# Altium schematic sheet CONTROL_485.SchDoc
size A2; SheetNumber: 1; SheetTotal: 4; DocumentName: MII_RESET.SCHDOC
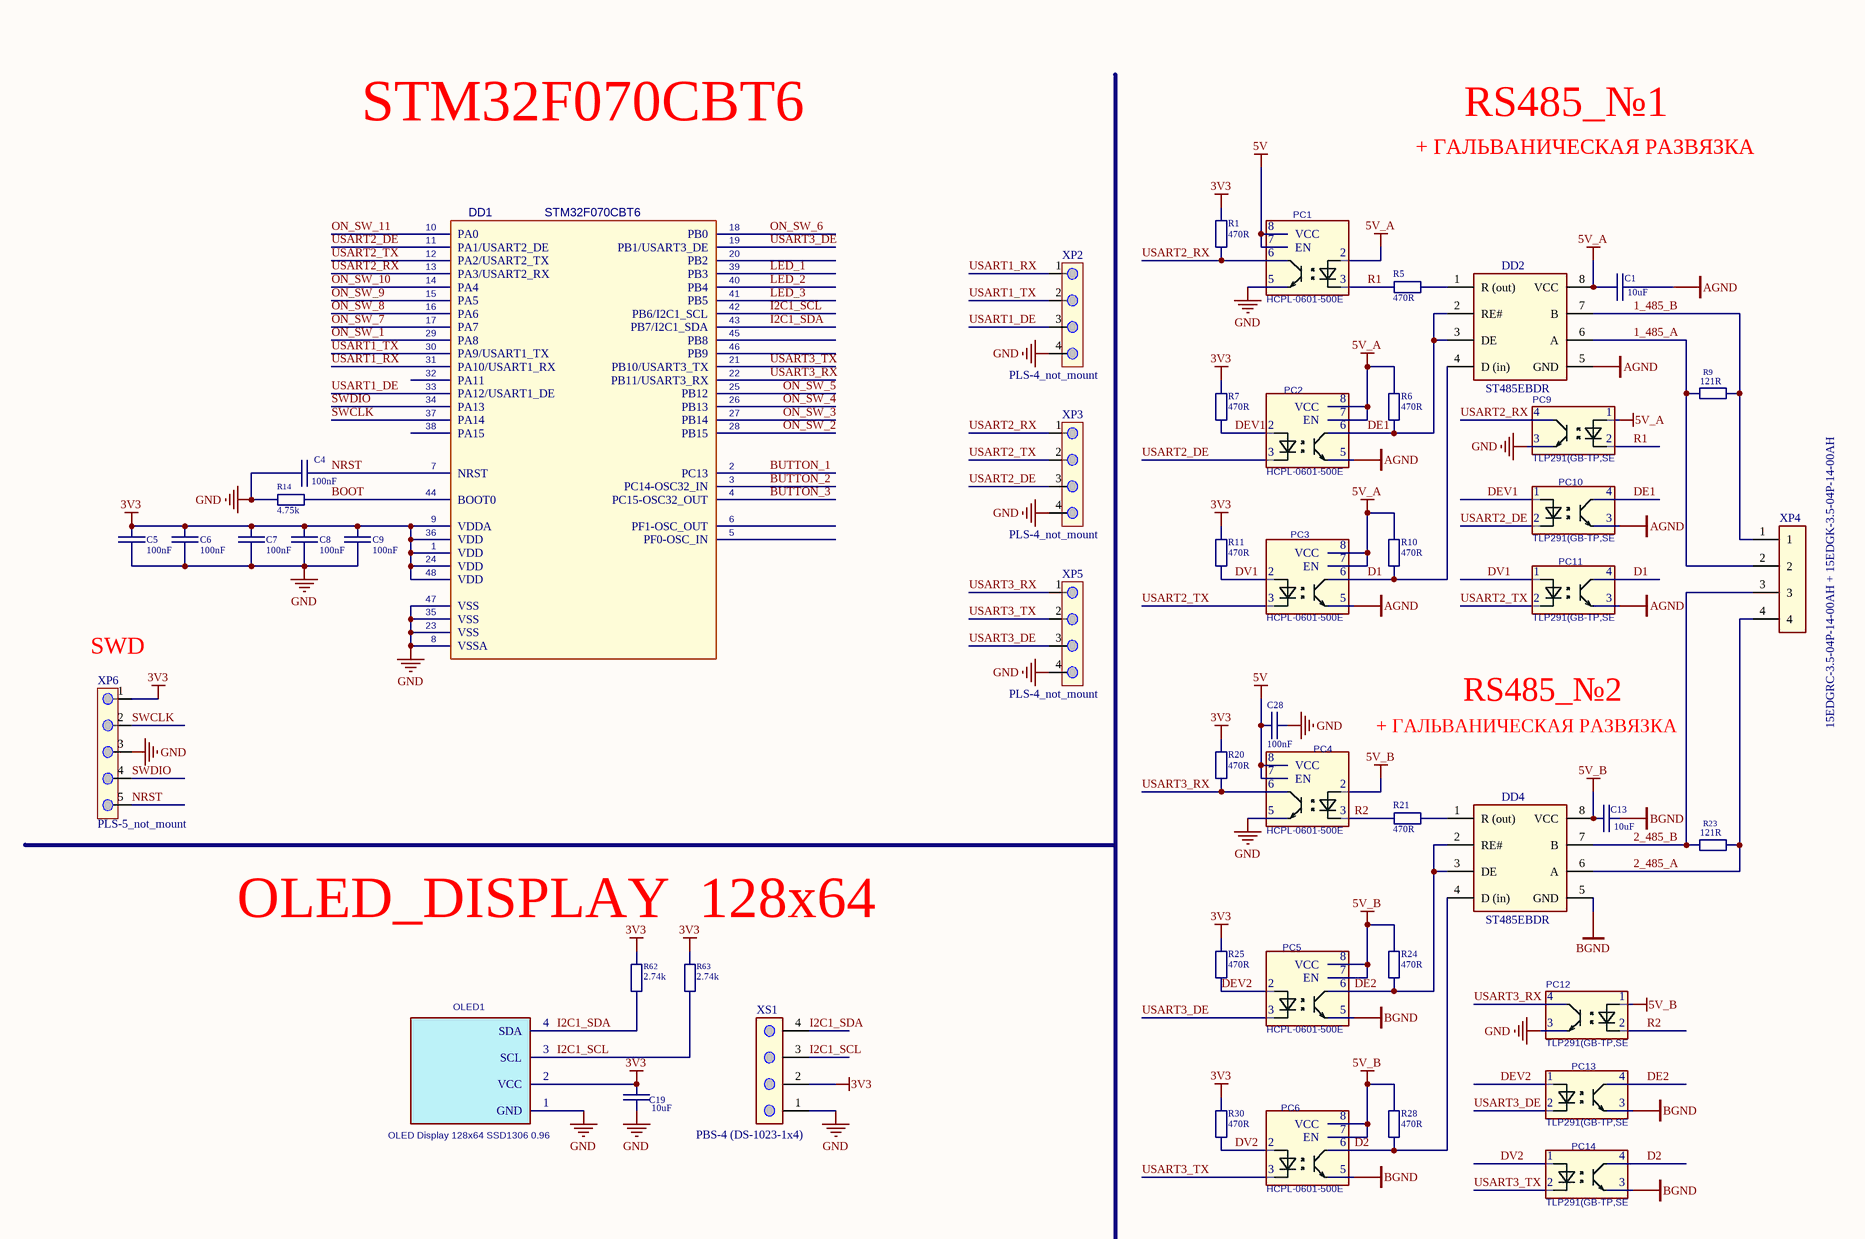
[diagram p0: CONTROL_485.SchDoc, top left]
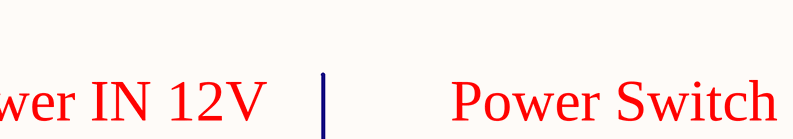
[diagram p1: CONTROL_485.SchDoc, top right]
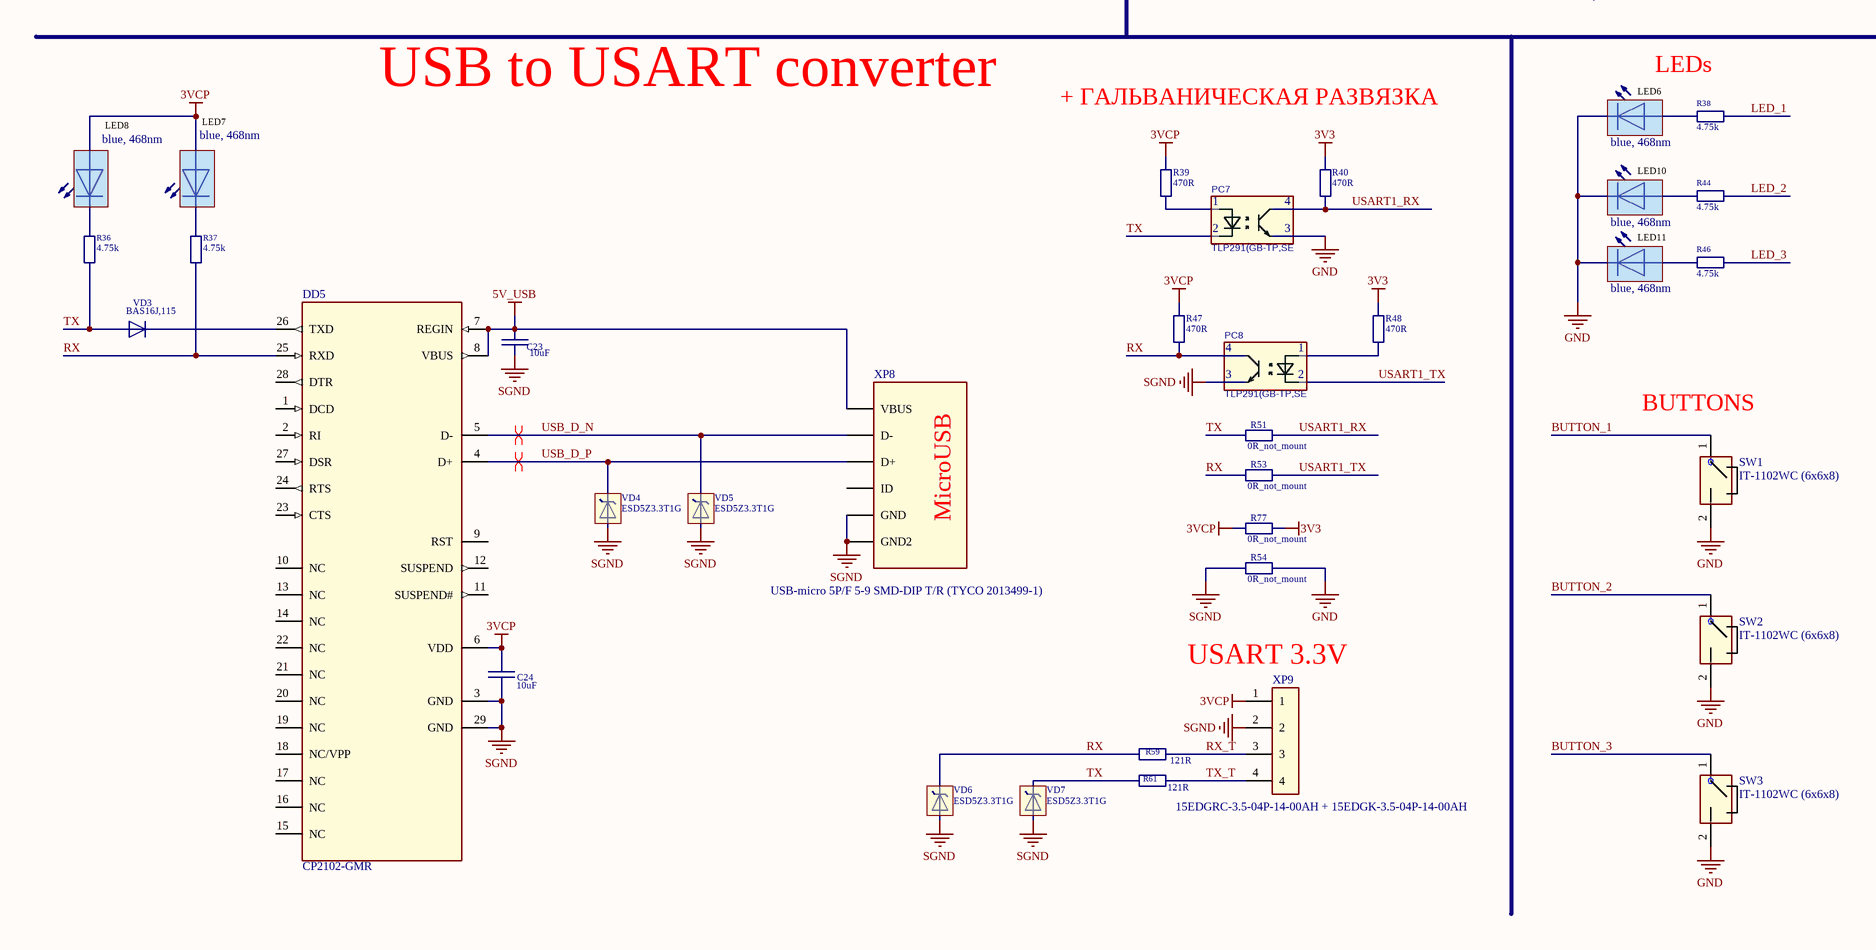
[diagram p2: CONTROL_485.SchDoc, bottom left]
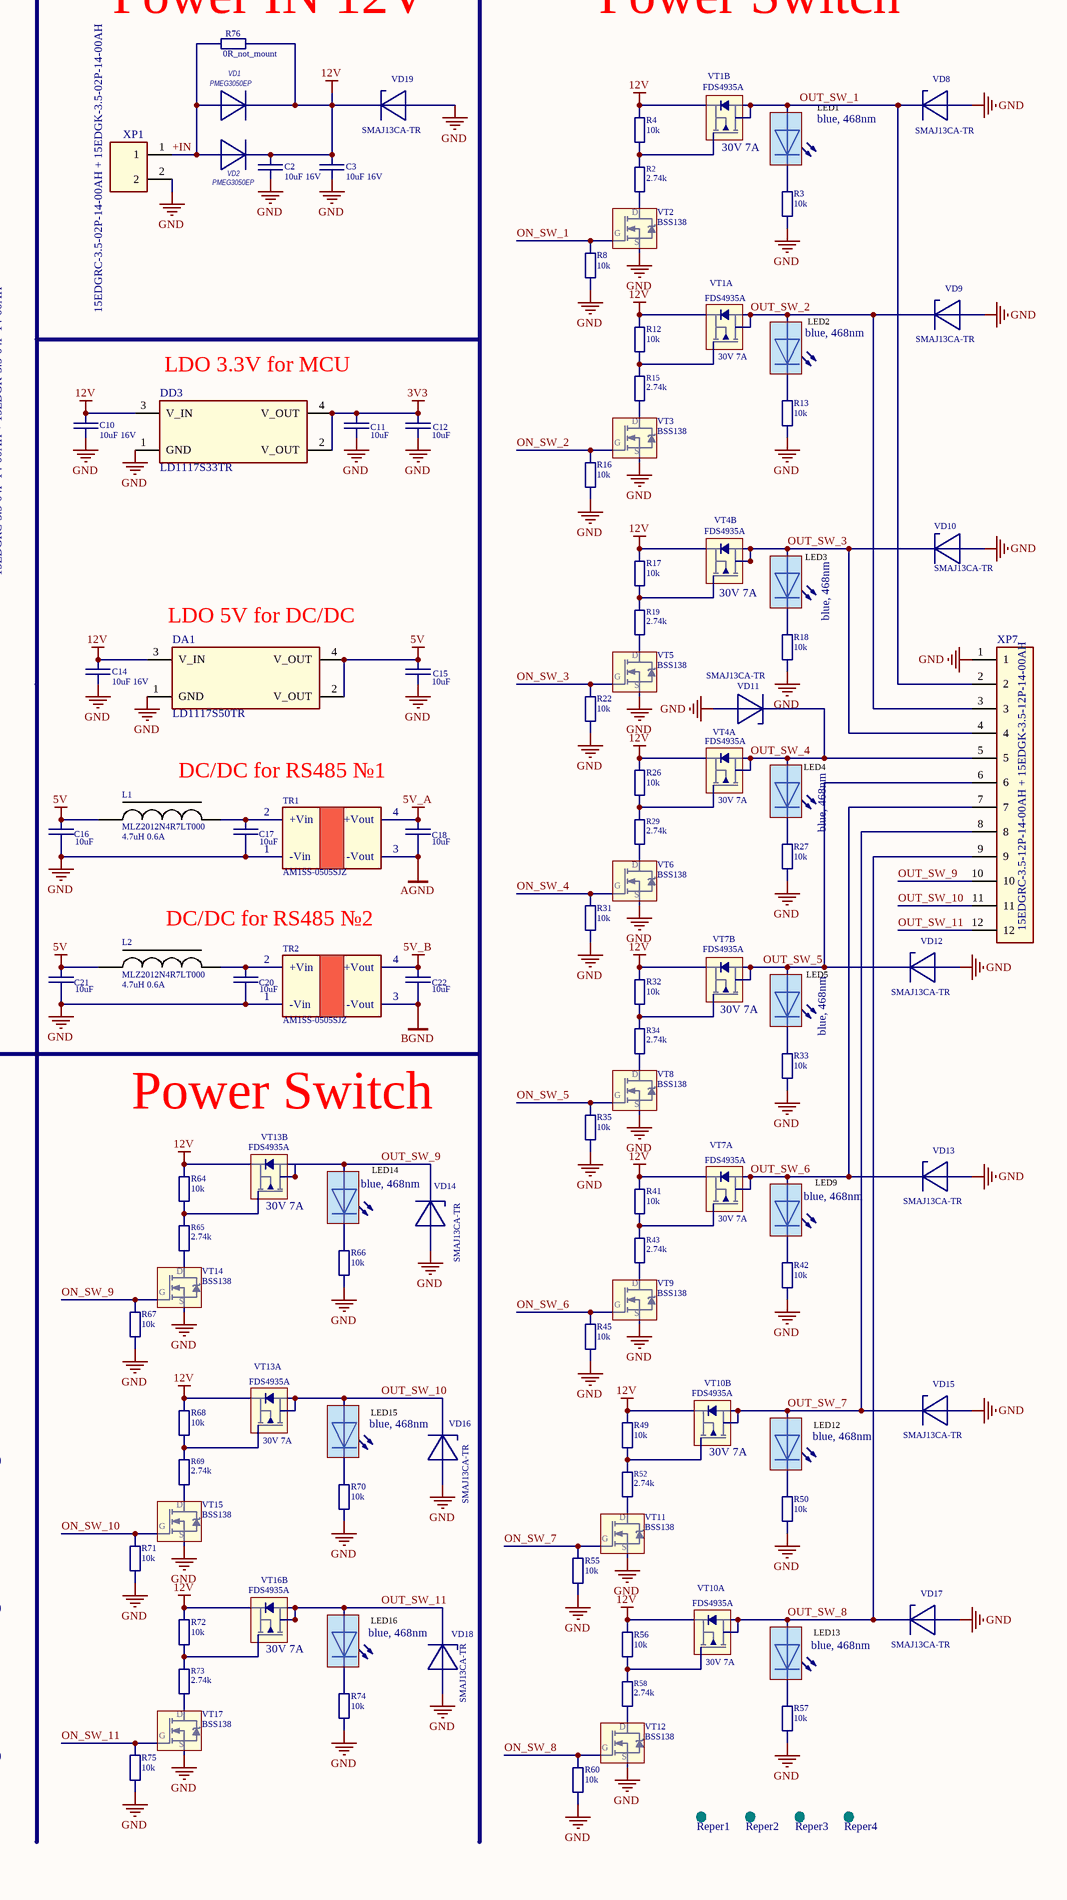
[diagram p3: CONTROL_485.SchDoc, bottom right]

## Parts
C1  Capacitance: 10uF  [C0805]  (hidden comment: C0805, 10uF, 10V, X5R)
C2  Capacitance: 10uF 16V  [C0805]  (hidden comment: C0805, 10uF, 16V, X5R)
C3  Capacitance: 10uF 16V  [C0805]  (hidden comment: C0805, 10uF, 16V, X5R)
C4  Capacitance: 100nF  [C0603]  (hidden comment: C0603, 100nF 50V)
C5  Capacitance: 100nF  [C0603]  (hidden comment: C0603, 100nF 50V)
C6  Capacitance: 100nF  [C0603]  (hidden comment: C0603, 100nF 50V)
C7  Capacitance: 100nF  [C0603]  (hidden comment: C0603, 100nF 50V)
C8  Capacitance: 100nF  [C0603]  (hidden comment: C0603, 100nF 50V)
C9  Capacitance: 100nF  [C0603]  (hidden comment: C0603, 100nF 50V)
C10  Capacitance: 10uF 16V  [C0805]  (hidden comment: C0805, 10uF, 16V, X5R)
C11  Capacitance: 10uF  [C0805]  (hidden comment: C0805, 10uF, 10V, X5R)
C12  Capacitance: 10uF  [C0805]  (hidden comment: C0805, 10uF, 10V, X5R)
C13  Capacitance: 10uF  [C0805]  (hidden comment: C0805, 10uF, 10V, X5R)
C14  Capacitance: 10uF 16V  [C0805]  (hidden comment: C0805, 10uF, 16V, X5R)
C15  Capacitance: 10uF  [C0805]  (hidden comment: C0805, 10uF, 10V, X5R)
C16  Capacitance: 10uF  [C0805]  (hidden comment: C0805, 10uF, 10V, X5R)
C17  Capacitance: 10uF  [C0805]  (hidden comment: C0805, 10uF, 10V, X5R)
C18  Capacitance: 10uF  [C0805]  (hidden comment: C0805, 10uF, 10V, X5R)
C19  Capacitance: 10uF  [C0805]  (hidden comment: C0805, 10uF, 10V, X5R)
C20  Capacitance: 10uF  [C0805]  (hidden comment: C0805, 10uF, 10V, X5R)
C21  Capacitance: 10uF  [C0805]  (hidden comment: C0805, 10uF, 10V, X5R)
C22  Capacitance: 10uF  [C0805]  (hidden comment: C0805, 10uF, 10V, X5R)
C23  Capacitance: 10uF  [C0805]  (hidden comment: C0805, 10uF, 10V, X5R)
C24  Capacitance: 10uF  [C0805]  (hidden comment: C0805, 10uF, 10V, X5R)
C28  Capacitance: 100nF  [C0603]  (hidden comment: C0603, 100nF 50V)
DA1  LD1117S50TR  [SOT223_N]
DD1  STM32F070CBT6  [LQFP48_L]
DD2  ST485EBDR  [SO-8_L]
DD3  LD1117S33TR  [SOT223_N]
DD4  ST485EBDR  [SO-8_L]
DD5  CP2102-GMR  [QFN28]
L1  MLZ2012N4R7LT000  [L0805]
L2  MLZ2012N4R7LT000  [L0805]
LED1  FYLS-0805BUBC  [LED_0805_B]  (value not drawn)
LED2  FYLS-0805BUBC  [LED_0805_B]  (value not drawn)
LED3  FYLS-0805BUBC  [LED_0805_B]  (value not drawn)
LED4  FYLS-0805BUBC  [LED_0805_B]  (value not drawn)
LED5  FYLS-0805BUBC  [LED_0805_B]  (value not drawn)
LED6  FYLS-0805BUBC  [LED_0805_B]  (value not drawn)
LED7  FYLS-0805BUBC  [LED_0805_B]  (value not drawn)
LED8  FYLS-0805BUBC  [LED_0805_B]  (value not drawn)
LED9  FYLS-0805BUBC  [LED_0805_B]  (value not drawn)
LED10  FYLS-0805BUBC  [LED_0805_B]  (value not drawn)
LED11  FYLS-0805BUBC  [LED_0805_B]  (value not drawn)
LED12  FYLS-0805BUBC  [LED_0805_B]  (value not drawn)
LED13  FYLS-0805BUBC  [LED_0805_B]  (value not drawn)
LED14  FYLS-0805BUBC  [LED_0805_B]  (value not drawn)
LED15  FYLS-0805BUBC  [LED_0805_B]  (value not drawn)
LED16  FYLS-0805BUBC  [LED_0805_B]  (value not drawn)
OLED1  OLED Display 128x64 SSD1306 0.96  [OLED Display 128x64 SSD1306 0.96]
PC1  HCPL-0601-500E  [SO-8_HCPL]
PC2  HCPL-0601-500E  [SO-8_HCPL]
PC3  HCPL-0601-500E  [SO-8_HCPL]
PC4  HCPL-0601-500E  [SO-8_HCPL]
PC5  HCPL-0601-500E  [SO-8_HCPL]
PC6  HCPL-0601-500E  [SO-8_HCPL]
PC7  TLP291(GB-TP,SE  [TLP292]
PC8  TLP291(GB-TP,SE  [TLP292]
PC9  TLP291(GB-TP,SE  [TLP292]
PC10  TLP291(GB-TP,SE  [TLP292]
PC11  TLP291(GB-TP,SE  [TLP292]
PC12  TLP291(GB-TP,SE  [TLP292]
PC13  TLP291(GB-TP,SE  [TLP292]
PC14  TLP291(GB-TP,SE  [TLP292]
R1  R0603, 470R 1%  [R0603]  (value not drawn)
R2  Resistance: 2.74k  [R0603]  (hidden comment: R0603, 2.74k 1%)
R3  Resistance: 10k  [R0603]  (hidden comment: R0603, 10k 1%)
R4  Resistance: 10k  [R0603]  (hidden comment: R0603, 10k 1%)
R5  R0603, 470R 1%  [R0603]  (value not drawn)
R6  R0603, 470R 1%  [R0603]  (value not drawn)
R7  R0603, 470R 1%  [R0603]  (value not drawn)
R8  Resistance: 10k  [R0603]  (hidden comment: R0603, 10k 1%)
R9  Resistance: 121R  [R0603]  (hidden comment: R0603, 121R 1%)
R10  R0603, 470R 1%  [R0603]  (value not drawn)
R11  R0603, 470R 1%  [R0603]  (value not drawn)
R12  Resistance: 10k  [R0603]  (hidden comment: R0603, 10k 1%)
R13  Resistance: 10k  [R0603]  (hidden comment: R0603, 10k 1%)
R14  Resistance: 4.75k  [R0603]  (hidden comment: R0603, 4.75k 1%)
R15  Resistance: 2.74k  [R0603]  (hidden comment: R0603, 2.74k 1%)
R16  Resistance: 10k  [R0603]  (hidden comment: R0603, 10k 1%)
R17  Resistance: 10k  [R0603]  (hidden comment: R0603, 10k 1%)
R18  Resistance: 10k  [R0603]  (hidden comment: R0603, 10k 1%)
R19  Resistance: 2.74k  [R0603]  (hidden comment: R0603, 2.74k 1%)
R20  R0603, 470R 1%  [R0603]  (value not drawn)
R21  R0603, 470R 1%  [R0603]  (value not drawn)
R22  Resistance: 10k  [R0603]  (hidden comment: R0603, 10k 1%)
R23  Resistance: 121R  [R0603]  (hidden comment: R0603, 121R 1%)
R24  R0603, 470R 1%  [R0603]  (value not drawn)
R25  R0603, 470R 1%  [R0603]  (value not drawn)
R26  Resistance: 10k  [R0603]  (hidden comment: R0603, 10k 1%)
R27  Resistance: 10k  [R0603]  (hidden comment: R0603, 10k 1%)
R28  R0603, 470R 1%  [R0603]  (value not drawn)
R29  Resistance: 2.74k  [R0603]  (hidden comment: R0603, 2.74k 1%)
R30  R0603, 470R 1%  [R0603]  (value not drawn)
R31  Resistance: 10k  [R0603]  (hidden comment: R0603, 10k 1%)
R32  Resistance: 10k  [R0603]  (hidden comment: R0603, 10k 1%)
R33  Resistance: 10k  [R0603]  (hidden comment: R0603, 10k 1%)
R34  Resistance: 2.74k  [R0603]  (hidden comment: R0603, 2.74k 1%)
R35  Resistance: 10k  [R0603]  (hidden comment: R0603, 10k 1%)
R36  Resistance: 4.75k  [R0603]  (hidden comment: R0603, 4.75k 1%)
R37  Resistance: 4.75k  [R0603]  (hidden comment: R0603, 4.75k 1%)
R38  Resistance: 4.75k  [R0603]  (hidden comment: R0603, 4.75k 1%)
R39  R0603, 470R 1%  [R0603]  (value not drawn)
R40  R0603, 470R 1%  [R0603]  (value not drawn)
R41  Resistance: 10k  [R0603]  (hidden comment: R0603, 10k 1%)
R42  Resistance: 10k  [R0603]  (hidden comment: R0603, 10k 1%)
R43  Resistance: 2.74k  [R0603]  (hidden comment: R0603, 2.74k 1%)
R44  Resistance: 4.75k  [R0603]  (hidden comment: R0603, 4.75k 1%)
R45  Resistance: 10k  [R0603]  (hidden comment: R0603, 10k 1%)
R46  Resistance: 4.75k  [R0603]  (hidden comment: R0603, 4.75k 1%)
R47  R0603, 470R 1%  [R0603]  (value not drawn)
R48  R0603, 470R 1%  [R0603]  (value not drawn)
R49  Resistance: 10k  [R0603]  (hidden comment: R0603, 10k 1%)
R50  Resistance: 10k  [R0603]  (hidden comment: R0603, 10k 1%)
R51  R0805, 0R_not_mount  [R0805]  (value not drawn)
R52  Resistance: 2.74k  [R0603]  (hidden comment: R0603, 2.74k 1%)
R53  R0805, 0R_not_mount  [R0805]  (value not drawn)
R54  R0805, 0R_not_mount  [R0805]  (value not drawn)
R55  Resistance: 10k  [R0603]  (hidden comment: R0603, 10k 1%)
R56  Resistance: 10k  [R0603]  (hidden comment: R0603, 10k 1%)
R57  Resistance: 10k  [R0603]  (hidden comment: R0603, 10k 1%)
R58  Resistance: 2.74k  [R0603]  (hidden comment: R0603, 2.74k 1%)
R59  Resistance: 121R  [R0603]  (hidden comment: R0603, 121R 1%)
R60  Resistance: 10k  [R0603]  (hidden comment: R0603, 10k 1%)
R61  Resistance: 121R  [R0603]  (hidden comment: R0603, 121R 1%)
R62  Resistance: 2.74k  [R0603]  (hidden comment: R0603, 2.74k 1%)
R63  Resistance: 2.74k  [R0603]  (hidden comment: R0603, 2.74k 1%)
R64  Resistance: 10k  [R0603]  (hidden comment: R0603, 10k 1%)
R65  Resistance: 2.74k  [R0603]  (hidden comment: R0603, 2.74k 1%)
R66  Resistance: 10k  [R0603]  (hidden comment: R0603, 10k 1%)
R67  Resistance: 10k  [R0603]  (hidden comment: R0603, 10k 1%)
R68  Resistance: 10k  [R0603]  (hidden comment: R0603, 10k 1%)
R69  Resistance: 2.74k  [R0603]  (hidden comment: R0603, 2.74k 1%)
R70  Resistance: 10k  [R0603]  (hidden comment: R0603, 10k 1%)
R71  Resistance: 10k  [R0603]  (hidden comment: R0603, 10k 1%)
R72  Resistance: 10k  [R0603]  (hidden comment: R0603, 10k 1%)
R73  Resistance: 2.74k  [R0603]  (hidden comment: R0603, 2.74k 1%)
R74  Resistance: 10k  [R0603]  (hidden comment: R0603, 10k 1%)
R75  Resistance: 10k  [R0603]  (hidden comment: R0603, 10k 1%)
R76  R0805, 0R_not_mount  [R0805]  (value not drawn)
R77  R0805, 0R_not_mount  [R0805]  (value not drawn)
Reper1  Reper  [REPER_1x3]  (value not drawn)  (no BOM)
Reper2  Reper  [REPER_1x3]  (value not drawn)  (no BOM)
Reper3  Reper  [REPER_1x3]  (value not drawn)  (no BOM)
Reper4  Reper  [REPER_1x3]  (value not drawn)  (no BOM)
SW1  IT-1102WC (6x6x8)  [IT-1102WC]
SW2  IT-1102WC (6x6x8)  [IT-1102WC]
SW3  IT-1102WC (6x6x8)  [IT-1102WC]
TR1  AM1SS-0505SJZ  [4-SIP (11.6x6x10.2)]
TR2  AM1SS-0505SJZ  [4-SIP (11.6x6x10.2)]
VD1  PMEG3050EP  [SOD128]
VD2  PMEG3050EP  [SOD128]
VD3  BAS16J,115  [SOD-323]
VD4  ESD5Z3.3T1G  [SOD-523]
VD5  ESD5Z3.3T1G  [SOD-523]
VD6  ESD5Z3.3T1G  [SOD-523]
VD7  ESD5Z3.3T1G  [SOD-523]
VD8  SMAJ13CA-TR  [SMA]
VD9  SMAJ13CA-TR  [SMA]
VD10  SMAJ13CA-TR  [SMA]
VD11  SMAJ13CA-TR  [SMA]
VD12  SMAJ13CA-TR  [SMA]
VD13  SMAJ13CA-TR  [SMA]
VD14  SMAJ13CA-TR  [SMA]
VD15  SMAJ13CA-TR  [SMA]
VD16  SMAJ13CA-TR  [SMA]
VD17  SMAJ13CA-TR  [SMA]
VD18  SMAJ13CA-TR  [SMA]
VD19  SMAJ13CA-TR  [SMA]
VT1  FDS4935A  [SO-8_L]  (parts A,B of 2)
VT2  BSS138  [SOT-23]
VT3  BSS138  [SOT-23]
VT4  FDS4935A  [SO-8_L]  (parts A,B of 2)
VT5  BSS138  [SOT-23]
VT6  BSS138  [SOT-23]
VT7  FDS4935A  [SO-8_L]  (parts A,B of 2)
VT8  BSS138  [SOT-23]
VT9  BSS138  [SOT-23]
VT10  FDS4935A  [SO-8_L]  (parts A,B of 2)
VT11  BSS138  [SOT-23]
VT12  BSS138  [SOT-23]
VT13  FDS4935A  [SO-8_L]  (parts A,B of 2)
VT14  BSS138  [SOT-23]
VT15  BSS138  [SOT-23]
VT16  FDS4935A  [SO-8_L]  (part B of 2)
VT17  BSS138  [SOT-23]
XP1  15EDGRC-3.5-02P-14-00AH + 15EDGK-3.5-02P-14-00AH  [15EDGRC-3.5-02P-14-00AH]
XP2  PLS-4_not_mount  [PLS-4_not_mount]
XP3  PLS-4_not_mount  [PLS-4_not_mount]
XP4  15EDGRC-3.5-04P-14-00AH + 15EDGK-3.5-04P-14-00AH  [15EDGRC-3.5-04P-14-00AH]
XP5  PLS-4_not_mount  [PLS-4_not_mount]
XP6  PLS-5_not_mount  [PLS-5_not_mount]  (no BOM)
XP7  15EDGRC-3.5-12P-14-00AH  [15EDGRC-3.5-12P-14-00AH]  (value not drawn)
XP8  USB-micro 5P/F 5-9 SMD-DIP T/R (TYCO 2013499-1)  [TYCO 2013499-1]
XP9  15EDGRC-3.5-04P-14-00AH + 15EDGK-3.5-04P-14-00AH  [15EDGRC-3.5-04P-14-00AH]
XS1  PBS-4 (DS-1023-1x4)  [PBS-4]

## Nets
3V3: C5.2 C6.2 C7.2 C8.2 C9.2 C11.2 C12.2 C19.1 DD1.1(VDD) DD1.9(VDDA) DD1.24(VDD) DD1.36(VDD) DD1.48(VDD) DD3.2(V_OUT) DD3.4(V_OUT) OLED1.2(VCC) R1.2 R7.2 R11.2 R20.2 R25.2 R30.2 R40.2 R48.2 R62.2 R63.2 R77.2 XP6.1 XS1.2
3VCP: C24.1 DD5.6(VDD) LED7.2(A) LED8.2(A) R39.2 R47.2 R77.1 XP9.1
5V: C15.2 C16.2 C21.2 C28.2 DA1.2(V_OUT) DA1.4(V_OUT) L1.1 L2.1 PC1.7(EN) PC1.8(VCC) PC4.7(EN) PC4.8(VCC)
5V_A: C1.1 C18.2 DD2.8(VCC) PC1.2 PC2.7(EN) PC2.8(VCC) PC3.7(EN) PC3.8(VCC) PC9.1 R6.2 R10.2 TR1.4(+Vout)
5V_B: C13.1 C22.2 DD4.8(VCC) PC4.2 PC5.7(EN) PC5.8(VCC) PC6.7(EN) PC6.8(VCC) PC12.1 R24.2 R28.1 TR2.4(+Vout)
5V_USB: C23.1 DD5.7(REGIN) DD5.8(VBUS) XP8.VBUS
12V: C2.2 C3.2 C10.2 C14.2 DA1.3(V_IN) DD3.3(V_IN) R4.2 R12.2 R17.2 R26.2 R32.2 R41.2 R49.2 R56.2 R64.2 R68.2 R72.2 R76.2 VD1.1 VD2.1 VD19.1 VT1.1(S2) VT1.3(S1) VT4.1(S2) VT4.3(S1) VT7.1(S2) VT7.3(S1) VT10.1(S2) VT10.3(S1) VT13.1(S2) VT13.3(S1) VT16.1(S2)
AGND: C1.2 C18.1 DD2.5(GND) PC2.5 PC3.5 PC10.3 PC11.3 TR1.3(-Vout)
BGND: C13.2 C22.1 DD4.5(GND) PC5.5 PC6.5 PC13.3 PC14.3 TR2.3(-Vout)
GND: C2.1 C3.1 C4.2 C5.1 C6.1 C7.1 C8.1 C9.1 C10.1 C11.1 C12.1 C14.1 C15.1 C16.1 C17.2 C19.2 C20.1 C21.1 C28.1 DA1.1(GND) DD1.8(VSSA) DD1.23(VSS) DD1.35(VSS) DD1.47(VSS) DD3.1(GND) LED6.1(K) LED10.1(K) LED11.1(K) OLED1.1(GND) PC1.5 PC4.5 PC7.3 PC9.3 PC12.3 R3.1 R8.1 R13.1 R14.2 R16.1 R18.1 R22.1 R27.1 R31.1 R33.1 R35.1 R42.1 R45.1 R50.1 R54.2 R55.1 R57.1 R60.1 R66.1 R67.1 R70.1 R71.1 R74.1 R75.1 SW1.2 SW2.2 SW3.2 TR1.1(-Vin) TR2.1(-Vin) VD8.2 VD9.2 VD10.2 VD11.2 VD12.2 VD13.2 VD14.2 VD15.2 VD16.2 VD17.2 VD18.2 VD19.2 VT2.2(S) VT3.2(S) VT5.2(S) VT6.2(S) VT8.2(S) VT9.2(S) VT11.2(S) VT12.2(S) VT14.2(S) VT15.2(S) VT17.2(S) XP1.2 XP2.4 XP3.4 XP5.4 XP6.3 XP7.1 XS1.1
SGND: C23.2 C24.2 DD5.3(GND) DD5.29(GND) PC8.3 R54.1 VD4.1 VD5.1 VD6.1 VD7.1 XP8.GND XP8.GND2 XP9.2
1_485_A: DD2.6(A) R9.1 XP4.2
1_485_B: DD2.7(B) R9.2 XP4.1
2_485_A: DD4.6(A) R23.2 XP4.4
2_485_B: DD4.7(B) R23.1 XP4.3
+IN: R76.1 VD1.2 VD2.2 XP1.1
BOOT: DD1.44(BOOT0) R14.1
BUTTON_1: DD1.2(PC13) SW1.1
BUTTON_2: DD1.3(PC14-OSC32_IN) SW2.1
BUTTON_3: DD1.4(PC15-OSC32_OUT) SW3.1
D1: DD2.4(D_(in)) PC3.6 PC11.4 R10.1
D2: DD4.4(D_(in)) PC6.6 PC14.4 R28.2
DE1: DD2.2(RE#) DD2.3(DE) PC2.6 PC10.4 R6.1
DE2: DD4.2(RE#) DD4.3(DE) PC5.6 PC13.4 R24.1
DEV1: PC2.2 PC10.1 R7.1
DEV2: PC5.2 PC13.1 R25.1
DV1: PC3.2 PC11.1 R11.1
DV2: PC6.2 PC14.1 R30.1
I2C1_SCL: DD1.42(PB6/I2C1_SCL) OLED1.3(SCL) R63.1 XS1.3
I2C1_SDA: DD1.43(PB7/I2C1_SDA) OLED1.4(SDA) R62.1 XS1.4
LED_1: DD1.39(PB3) R38.2
LED_2: DD1.40(PB4) R44.2
LED_3: DD1.41(PB5) R46.2
NRST: C4.1 DD1.7(NRST) XP6.5
ON_SW_1: DD1.29(PA8) R8.2 VT2.1(G)
ON_SW_2: DD1.28(PB15) R16.2 VT3.1(G)
ON_SW_3: DD1.27(PB14) R22.2 VT5.1(G)
ON_SW_4: DD1.26(PB13) R31.2 VT6.1(G)
ON_SW_5: DD1.25(PB12) R35.2 VT8.1(G)
ON_SW_6: DD1.18(PB0) R45.2 VT9.1(G)
ON_SW_7: DD1.17(PA7) R55.2 VT11.1(G)
ON_SW_8: DD1.16(PA6) R60.2 VT12.1(G)
ON_SW_9: DD1.15(PA5) R67.2 VT14.1(G)
ON_SW_10: DD1.14(PA4) R71.2 VT15.1(G)
ON_SW_11: DD1.10(PA0) R75.2 VT17.1(G)
OUT_SW_1: LED1.2(A) VD8.1 VT1.7(D2) VT1.8(D2) XP7.2
OUT_SW_2: LED2.2(A) VD9.1 VT1.5(D1) VT1.6(D1) XP7.3
OUT_SW_3: LED3.2(A) VD10.1 VT4.7(D2) VT4.8(D2) XP7.4
OUT_SW_4: LED4.2(A) VD11.1 VT4.5(D1) VT4.6(D1) XP7.5
OUT_SW_5: LED5.2(A) VD12.1 VT7.7(D2) VT7.8(D2) XP7.6
OUT_SW_6: LED9.2(A) VD13.1 VT7.5(D1) VT7.6(D1) XP7.7
OUT_SW_7: LED12.2(A) VD15.1 VT10.7(D2) VT10.8(D2) XP7.8
OUT_SW_8: LED13.2(A) VD17.1 VT10.5(D1) VT10.6(D1) XP7.9
OUT_SW_9: LED14.2(A) VD14.1 VT13.7(D2) VT13.8(D2) XP7.10
OUT_SW_10: LED15.2(A) VD16.1 VT13.5(D1) VT13.6(D1) XP7.11
OUT_SW_11: LED16.2(A) VD18.1 VT16.7(D2) VT16.8(D2) XP7.12
R1: PC1.3 PC9.2 R5.1
R2: PC4.3 PC12.2 R21.1
RX: DD5.25(RXD) PC8.4 R37.2 R47.1 R53.1 R59.1 VD6.2
RX_T: R59.2 XP9.3
SWCLK: DD1.37(PA14) XP6.2
SWDIO: DD1.34(PA13) XP6.4
TX: PC7.2 R36.2 R51.1 R61.1 VD3.2 VD7.2
TX_T: R61.2 XP9.4
USART1_DE: DD1.33(PA12/USART1_DE) XP2.3
USART1_RX: DD1.31(PA10/USART1_RX) PC7.4 R40.1 R51.2 XP2.1
USART1_TX: DD1.30(PA9/USART1_TX) PC8.2 R53.2 XP2.2
USART2_DE: DD1.11(PA1/USART2_DE) PC2.3 PC10.2 XP3.3
USART2_RX: DD1.13(PA3/USART2_RX) PC1.6 PC9.4 R1.1 XP3.1
USART2_TX: DD1.12(PA2/USART2_TX) PC3.3 PC11.2 XP3.2
USART3_DE: DD1.19(PB1/USART3_DE) PC5.3 PC13.2 XP5.3
USART3_RX: DD1.22(PB11/USART3_RX) PC4.6 PC12.4 R20.1 XP5.1
USART3_TX: DD1.21(PB10/USART3_TX) PC6.3 PC14.2 XP5.2
USB_D_N: DD5.5(D-) VD5.2 XP8.D-
USB_D_P: DD5.4(D+) VD4.2 XP8.D+
NetC17_1: C17.1 L1.2 TR1.2(+Vin)
NetC20_2: C20.2 L2.2 TR2.2(+Vin)
NetDD2_1: DD2.1(R_(out)) R5.2
NetDD4_1: DD4.1(R_(out)) R21.2
NetDD5_26: DD5.26(TXD) VD3.1
NetLED1_1: LED1.1(K) R3.2
NetLED2_1: LED2.1(K) R13.2
NetLED3_1: LED3.1(K) R18.2
NetLED4_1: LED4.1(K) R27.2
NetLED5_1: LED5.1(K) R33.2
NetLED6_2: LED6.2(A) R38.1
NetLED7_1: LED7.1(K) R37.1
NetLED8_1: LED8.1(K) R36.1
NetLED9_1: LED9.1(K) R42.2
NetLED10_2: LED10.2(A) R44.1
NetLED11_2: LED11.2(A) R46.1
NetLED12_1: LED12.1(K) R50.2
NetLED13_1: LED13.1(K) R57.2
NetLED14_1: LED14.1(K) R66.2
NetLED15_1: LED15.1(K) R70.2
NetLED16_1: LED16.1(K) R74.2
NetPC7_1: PC7.1 R39.1
NetPC8_1: PC8.1 R48.1
NetR2_1: R2.1 R4.1 VT1.2(G2)
NetR2_2: R2.2 VT2.3(D)
NetR12_1: R12.1 R15.1 VT1.4(G1)
NetR15_2: R15.2 VT3.3(D)
NetR17_1: R17.1 R19.1 VT4.2(G2)
NetR19_2: R19.2 VT5.3(D)
NetR26_1: R26.1 R29.1 VT4.4(G1)
NetR29_2: R29.2 VT6.3(D)
NetR32_1: R32.1 R34.1 VT7.2(G2)
NetR34_2: R34.2 VT8.3(D)
NetR41_1: R41.1 R43.1 VT7.4(G1)
NetR43_2: R43.2 VT9.3(D)
NetR49_1: R49.1 R52.1 VT10.2(G2)
NetR52_2: R52.2 VT11.3(D)
NetR56_1: R56.1 R58.1 VT10.4(G1)
NetR58_2: R58.2 VT12.3(D)
NetR64_1: R64.1 R65.1 VT13.2(G2)
NetR65_2: R65.2 VT14.3(D)
NetR68_1: R68.1 R69.1 VT13.4(G1)
NetR69_2: R69.2 VT15.3(D)
NetR72_1: R72.1 R73.1 VT16.2(G2)
NetR73_2: R73.2 VT17.3(D)

Not connected (* = marked no-connect by the designer): DD1 5(PF0-OSC_IN) 6(PF1-OSC_OUT) 20(PB2) 32(PA11) 38(PA15) 45(PB8) 46(PB9); DD5 1(DCD) 2(RI) 9(RST) 10(NC) 11(SUSPEND#) 12(SUSPEND) 13(NC) 14(NC) 15(NC) 16(NC) 17(NC) 18(NC/VPP) 19(NC) 20(NC) 21(NC) 22(NC) 23(CTS) 24(RTS) 27(DSR) 28(DTR); XP8 ID

## Layout directives
differential pair: USB_D_N, USB_D_P

## Notes on the sheet
- STM32F070CBT6
- RS485_№1
- + ГАЛЬВАНИЧЕСКАЯ РАЗВЯЗКА
- (near R76) Power IN 12V
- Power Switch
- LDO 3.3V for MCU
- (near XP6) SWD
- RS485_№2
- (near DA1) LDO 5V for DC/DC
- OLED_DISPLAY  128x64
- DC/DC for RS485 №1
- DC/DC for RS485 №2
- LEDs
- USB to USART converter
- (near SW1) BUTTONS
- MicroUSB
- (near XP9) USART 3.3V
- (in symbol FDS4935A, part A) 30V 7A
- (in symbol FDS4935A, part B) 30V 7A
- (in symbol FYLS-0805BUBC) blue, 468nm
- (in symbol MLZ2012N4R7LT000) 4.7uH 0.6A
- (in symbol R0805, 0R_not_mount) 0R_not_mount

## Library data of the parts
DA1 = LD1117S50TR: IC REG LDO 0.8A 5V SOT223-4; Manufacturer Part Number: NX1117C33Z,115; Manufacturer: NXP Semiconductors; Voltage - Input: Up to 20V; Voltage - Output: 3.3V; Number of Regulators: 1; Current - Output: 1A (Max); Regulator Topology: Positive Fixed; Current - Limit (Min): 1A; Voltage - Dropout (Typical): 1.07V @ 800mA; Supplier 1: Digi-Key; Supplier Part Number 1: 568-9520-2-ND; Supplier: Digi-Key; Supplier Part Number: 568-9520-2-ND; Category: Integrated Circuits (ICs); Mounting Type: Surface Mount; Packaging: Tape & Reel (TR); Supplier Device Package: SC-73; RoHS: RoHS Compliant; Operating Temperature: -40°C ~ 125°C; Package / Case: TO-261-4, TO-261AA; ComponentLink1URL: http://www.nxp.com/documents/data_sheet/NX1117C_NX1117CE_SER.pdf; ComponentLink1Description: http://www.nxp.com/documents/data_sheet/NX1117C_NX1117CE_SER.pdf; Pricing: 1000=0.30992, 2000=0.28087, 5000=0.2615, 10000=0.25181, 25000=0.24213, 50000=0.23825, 100000=0.23244 (USD)
DD1 = STM32F070CBT6: ARM® Cortex®-M0 STM32F0 Microcontroller IC 32-Bit 48MHz 128KB (128K x 8) FLASH 48-LQFP (7x7)
DD2 DD4 = ST485EBDR: Transceiver RS485, 8-SOIC
DD3 = LD1117S33TR: IC REG LDO 0.8A 3.3V SOT223-4; Manufacturer Part Number: NX1117C33Z,115; Manufacturer: NXP Semiconductors; Voltage - Input: Up to 20V; Number of Regulators: 1; Current - Output: 1A (Max); Regulator Topology: Positive Fixed; Current - Limit (Min): 1A; Voltage - Dropout (Typical): 1.07V @ 800mA; Supplier 1: Digi-Key; Supplier Part Number 1: 568-9520-2-ND; Supplier: Digi-Key; Supplier Part Number: 568-9520-2-ND; Category: Integrated Circuits (ICs); Mounting Type: Surface Mount; Packaging: Tape & Reel (TR); Supplier Device Package: SC-73; RoHS: RoHS Compliant; Voltage - Output: 3.3V; Operating Temperature: -40°C ~ 125°C; Package / Case: TO-261-4, TO-261AA; ComponentLink1URL: http://www.nxp.com/documents/data_sheet/NX1117C_NX1117CE_SER.pdf; ComponentLink1Description: http://www.nxp.com/documents/data_sheet/NX1117C_NX1117CE_SER.pdf; Pricing: 1000=0.30992, 2000=0.28087, 5000=0.2615, 10000=0.25181, 25000=0.24213, 50000=0.23825, 100000=0.23244 (USD)
DD5 = CP2102-GMR: IC USB-TO-UART BRIDGE 28VQFN
L1 L2 = MLZ2012N4R7LT000: 4.7µH Shielded Multilayer Inductor 600mA 180mOhm 0805 (2012 Metric)
LED1-LED16 = FYLS-0805BUBC: LED, blue, 0805
PC1-PC6 = HCPL-0601-500E: OPTOISO 3.75KV OPN COLLECTOR 8SO
PC7-PC14 = TLP291(GB-TP,SE: Photocoupler TLP291
R51 R53 R54 R76 R77 = R0805, 0R_not_mount: Tolerance: ±1%
SW1-SW3 = IT-1102WC (6x6x8): Horizontal Push Tact Switch
TR1 TR2 = AM1SS-0505SJZ: Isolated Module DC DC Converter 1 Output 5V    200mA 4.5V - 5.5V Input
VD1 VD2 = PMEG3050EP: DIODE 5 A 30 V Schottky barrier rectifier; Manufacturer Part Number: PMEG3050EP,115; Manufacturer: NXP Semiconductors; Speed: Fast Recovery =< 500ns, > 200mA (Io); Capacitance @ Vr, F: 800pF @ 1V, 1MHz; Current - Reverse Leakage @ Vr: 8mA @ 30V; Voltage - Forward (Vf) (Max) @ If: 360mV @ 5A; Current - Average Rectified (Io): 5A; Voltage - DC Reverse (Vr) (Max): 30V; Category: Discrete Semiconductor Products; Supplier: Digi-Key; Package / Case: SOD-128; Supplier Device Package: SOD-128; Packaging: Digi-Reel®; RoHS: RoHS Compliant; Diode Type: Schottky; Reverse Recovery Time (trr): -; Mounting Type: Surface Mount; Supplier Part Number: 568-6753-6-ND; ComponentLink1URL: http://www.nxp.com/documents/data_sheet/PMEG3050EP.pdf; ComponentLink1Description: http://www.nxp.com/documents/data_sheet/PMEG3050EP.pdf; Pricing: 1=0.52, 10=0.437, 25=0.3828, 100=0.3275, 250=0.28408, 500=0.24062, 1000=0.1855 (USD)
VD3 = BAS16J,115: Switching Diode 250MA 100V SOD323
VD4-VD7 = ESD5Z3.3T1G: TVS ESD SOD−523
VD8-VD19 = SMAJ13CA-TR: TVS DIODE 13V 27.2V SMA
VT1 VT4 VT7 VT10 VT13 VT16 = FDS4935A: Mosfet Array 2 P-Channel 30V 7A  8-SO
VT2 VT3 VT5 VT6 VT8 VT9 VT11 VT12 VT14 VT15 VT17 = BSS138: N-Channel 50V 220mA (Ta) 360mW (Ta) Surface Mount SOT-23-3; Part Number: BSS138_ON Semiconductor; Value: BSS138; MOUNTING: SMD
XP1 = 15EDGRC-3.5-02P-14-00AH: Connector 15EDGRC-3.5-02P-14-00AH + 15EDGK-3.5-02P-14-00AH
XP2 XP3 XP5 = PLS-4_not_mount: Connector PLS-4 (2.54mm x1)
XP4 XP9 = 15EDGRC-3.5-04P-14-00AH: Connector 15EDGRC-3.5-04P-14-00AH + 15EDGK-3.5-04P-14-00AH
XP6 = PLS-5_not_mount: Connector PLS-5 (2.54mm x1)_not_mount
XP7 = 15EDGRC-3.5-12P-14-00AH: 15EDGRC-3.5-12P-14-00AH + 15EDGK-3.5-12P-14-00AH
XP8 = USB-micro 5P/F 5-9 SMD-DIP T/R (TYCO 2013499-1): Micro USB 5S-B
XS1 = PBS-4 (DS-1023-1x4): Connector PBS-04 (2.54mm x1)
R1 R5-R7 R10 R11 R20 R21 R24 R25 R28 R30 R39 R40 R47 R48 = R0603, 470R 1%: MOUNTING: SMD; ALTERNATE: *; Value: 470R